# Altium schematic sheet USB-power.SchDoc: Thymio2
size A4; Organization: Original design LSRO-STI-EPFL; Address1: Association Mobsya; Address2: Michael Bonani; Address3: Ch. Closel 3; Address4: CH-1020 Renens; DocumentNumber: 3; Revision: 2.3; SheetNumber: 3; SheetTotal: 9; Engineer: Michael Bonani; Title2: PCB principal; ProjectName: Project Name
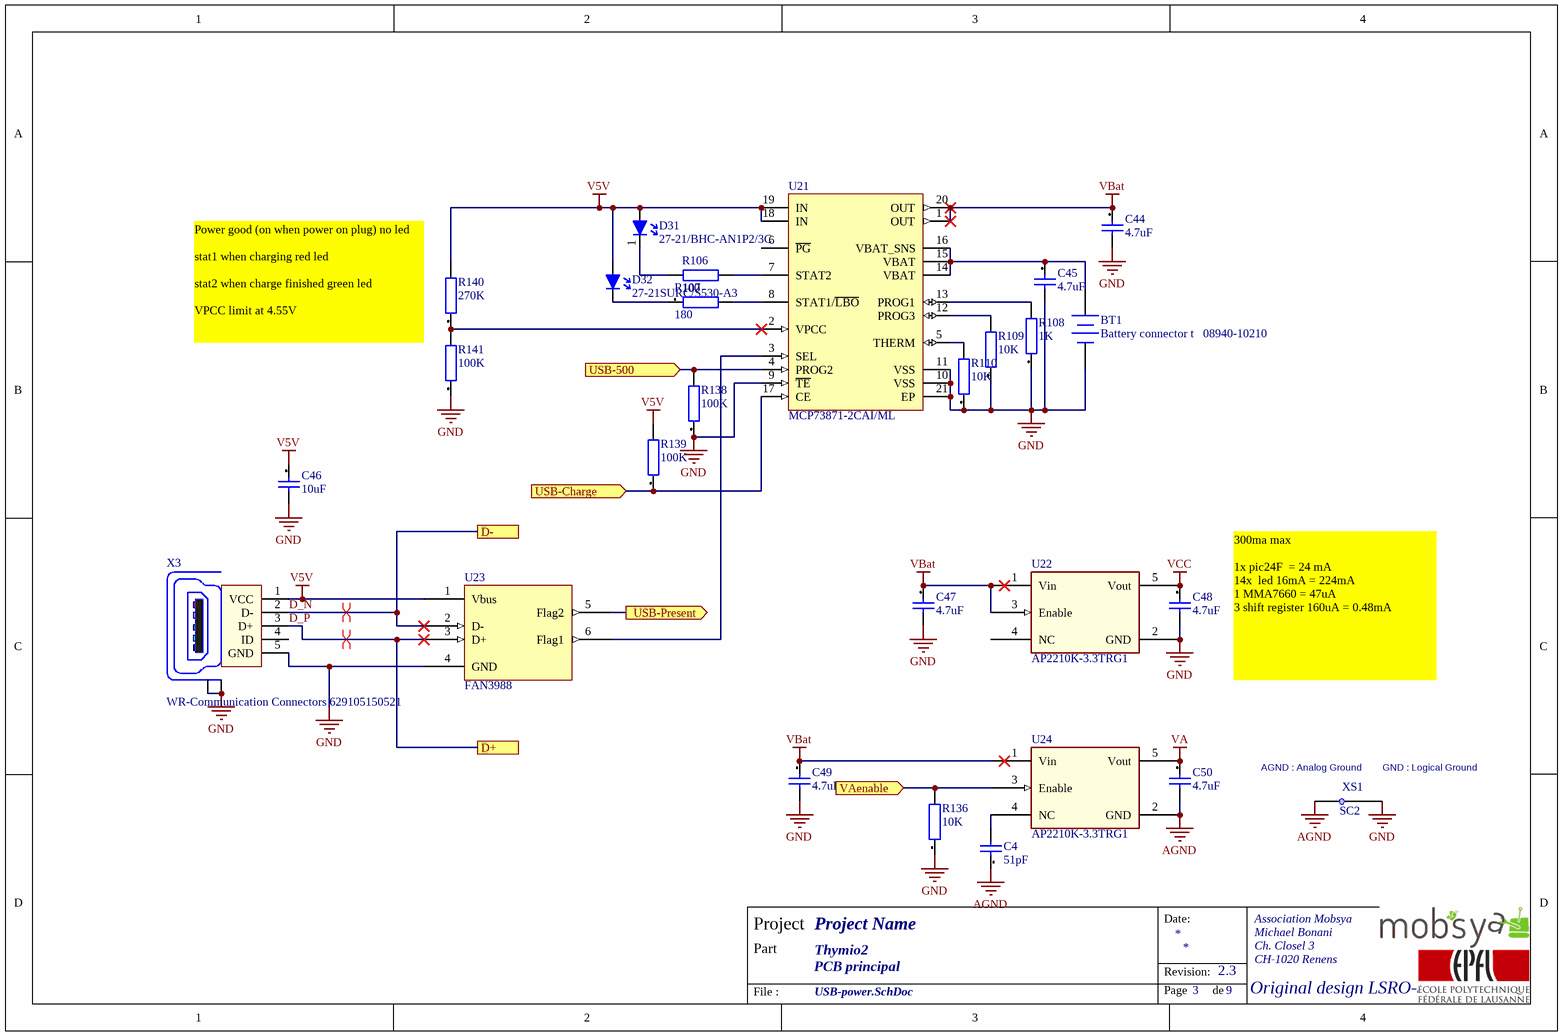
[diagram p0: USB-power.SchDoc]

## Parts
BT1  Battery connector t   08940-10210  [BAT-2]
C4  51pF  [CAPC1005X05N]
C44  4.7uF  [CAPC1005X05N]
C45  4.7uF  [CAPC1005X05N]
C46  10uF  [CAPC1005X05N]
C47  4.7uF  [CAPC1005X05N]
C48  4.7uF  [CAPC1005X05N]
C49  4.7uF  [CAPC1005X05N]
C50  4.7uF  [CAPC1005X05N]
D31  27-21/BHC-AN1P2/3C  [27-21 Everlight Blue]
D32  27-21SURC/S530-A3  [27-21 Everlight]
R106  100  [RESC1005X04N]
R107  180  [RESC1005X04N]
R108  1K  [RESC1005X04N]
R109  10K  [RESC1005X04N]
R110  10K  [RESC1005X04N]
R136  10K  [RESC1005X04N]
R138  100K  [RESC1005X04N]
R139  100K  [RESC1005X04N]
R140  270K  [RESC1005X04N]
R141  100K  [RESC1005X04N]
U21  MCP73871-2CAI/ML  [QFN-ML20_N]
U22  AP2210K-3.3TRG1  [SOT95P285X100-5N]
U23  FAN3988  [MLP 1.45x1mm]
U24  AP2210K-3.3TRG1  [SOT95P285X100-5N]
X3  WR-Communication Connectors 629105150521  [629105150521]
XS1  SC2  [CC_SC2]  (net tie, no BOM)

## Ports
D+, D-, USB-500 (in), USB-Charge (in), USB-Present (out), VAenable (in)

## Nets
AGND: C4.1 C50.2 U24.2(GND) XS1.2
GND: BT1.2(-) C44.2 C45.2 C46.2 C47.2 C48.2 C49.2 R108.1 R109.1 R110.1 R136.1 R138.1 R141.1 U21.9(~{TE}) U21.10(VSS) U21.11(VSS) U21.21(EP) U22.2(GND) U23.4(GND) X3.5(GND) X3.Z1(Shield) X3.Z2(Shield) XS1.1
V5V: C46.1 D31.2(A) D32.2(A) R139.2 R140.2 U21.18(IN) U21.19(IN) U23.1(Vbus) X3.1(VCC)
VA: C50.1 U24.5(Vout)
VBat: C44.1 C47.1 C49.1 U21.1(OUT) U21.20(OUT) U22.1(Vin) U22.3(Enable) U24.1(Vin)
VCC: C48.1 U22.5(Vout)
D_N: U23.2(D-) X3.2(D-) ; port D-
D_P: U23.3(D+) X3.3(D+) ; port D+
USB-500: R138.2 U21.4(PROG2) ; port USB-500
USB-Charge: R139.1 U21.17(CE) ; port USB-Charge
USB-Present: U23.5(Flag2) ; port USB-Present
VAenable: R136.2 U24.3(Enable) ; port VAenable
NetBT1_1: BT1.1(+) C45.1 U21.14(VBAT) U21.15(VBAT) U21.16(VBAT_SNS)
NetC4_2: C4.2 U24.4(NC)
NetD31_1: D31.1(K) R106.2
NetD32_1: D32.1(K) R107.1
NetR106_1: R106.1 U21.7(STAT2)
NetR107_2: R107.2 U21.8(STAT1/~{LBO})
NetR108_2: R108.2 U21.13(PROG1)
NetR109_2: R109.2 U21.12(PROG3)
NetR110_2: R110.2 U21.5(THERM)
NetR140_1: R140.1 R141.2 U21.2(VPCC)
NetU21_3: U21.3(SEL) U23.6(Flag1)

Not connected (* = marked no-connect by the designer): U21 6(~{PG}); U22 4(NC); X3 4(ID)

## Layout directives
differential pair: D_N, D_P

## Notes on the sheet
- Power good (on when power on plug) no led
  stat1 when charging red led
  stat2 when charge finished green led
  VPCC limit at 4.55V
- 300ma max
  1x pic24F		= 24 mA
  14x  led 16mA	= 224mA
  1 MMA7660	= 47uA
  3 shift register 160uA = 0.48mA
- (near XS1) AGND : Analog Ground
- (near XS1) GND : Logical Ground
- Date:
- Project
- Part
- Revision:
- File :
- Page
- de

## Library data of the parts
BT1 = Battery: Multicell Battery; LayerSch: Top; Published: 24-Mar-1999; LatestRevisionDate: 17-Jul-2002; LatestRevisionNote: Re-released for DXP Platform.; PackageReference: BAT-2; Publisher: Altium Limited
C4 = 10nF[[/\]]0603[[/\]]1: Capacitor; Manufacturer: Multicomp; Manufacturer Nr: U0603R103KCT; Preference: 1; Tolerance +: +10; Tolerance -: -10; Dielectric: X7R; Voltage: 50; MaxTemperature: +125; MinTemperature: -55; Quant_1: 10; Quant_2: 100; Quant_3: 1000; Currentie: CHF; LayerSch: Top; Size: 0603; Footprint Acort: 0603_G; Supplier: Farnell; Supplier Nr: 9406182; ComponentLink2Description: Farnell link; ComponentLink2URL: http://ch.farnell.com/jsp/displayProduct.jsp?sku=9406182; Price_1: 0.062; Price_2: 0.041; Price_3: 0.021; ROHS: True; DateLastUpdate: 2007-12-03 / 14:22:34
C44 C45 C47-C50 = 4.7uF[[/\]]0603[[/\]]1: Capacitor; Manufacturer: Kemet; Manufacturer Nr: C0603C475K9PAC; Preference: 1; Tolerance +: +10; Tolerance -: -10; Dielectric: X5R; Voltage: 6.3; MaxTemperature: +85; MinTemperature: -55; Quant_1: 10; Quant_2: 100; Quant_3: 1000; Quant_4: 4000; Currentie: CHF; LayerSch: Top; Size: 0603; Footprint Acort: 0603_G; Supplier: Farnell; Supplier Nr: 9227784; ComponentLink2Description: Farnell link; ComponentLink2URL: http://ch.farnell.com/jsp/displayProduct.jsp?sku=9227784; Price_1: 0.33; Price_2: 0.298; Price_3: 0.278; Price_4: 0.246; ROHS: True; DateLastUpdate: 2007-12-03 / 14:22:57
C46 = 10uF[[/\]]0603[[/\]]1: Capacitor; Manufacturer: Taiyo Yuden; Manufacturer Nr: JMK107BJ106MA-T; Preference: 1; Tolerance +: +15; Tolerance -: -15; Dielectric: X5R; Voltage: 6.3; MaxTemperature: +85; MinTemperature: -55; Quant_2: 100; Quant_3: 500; Currentie: CHF; LayerSch: Top; Size: 0603; Footprint Acort: 0603_G; Supplier: Farnell; Supplier Nr: 1463375; ComponentLink2Description: Farnell link; ComponentLink2URL: http://ch.farnell.com/jsp/displayProduct.jsp?sku=1463375; Quant_1: 1; Price_1: 0.768; Price_2: 0.674; Price_3: 0.372; ROHS: True; DateLastUpdate: 2007-12-03 / 14:22:36
D31 = LED: SMD Blue led right angle mount 3.3V@20ma 28mcd; VerifiedComment: ToDo; LayerSch: Top
D32 = LED: SMD Red led right angle mount 2V@20ma 57mcd; VerifiedComment: ToDo; LayerSch: Top
R106 = RES_ACORT: Resistance; ClassName: IR
R107 = 180R[[/\]]0603[[/\]]1: Resistor; Manufacturer: Vishay; Manufacturer Nr: D11CRCW06030B4703F; Tolerance: +/-1; Preference: 1; Power: 0.1; Voltage: 75; Current: 1.5; ppm/K: +/-100; Quant_1: 10; Quant_2: 100; Quant_3: 500; Currentie: CHF; LayerSch: Top; Size: 0603; Footprint Acort: 0603; Supplier: Distrelec; Supplier Nr: 715570; ComponentLink2Description: Distrelec link; ComponentLink2URL: http://www.distrelec.com/ishopWebFront/search/luceneSearch.do?dispatch=find&showImage=on&artnrPhrase=715570; ROHS: True; Price_1: 0.0538; Price_2: 0.0323; Price_3: 0.0204; DateLastUpdate: 2007-12-03 / 16:30:19
R108 = 1K[[/\]]0603[[/\]]1: Resistor; Manufacturer: Vishay; Manufacturer Nr: D11CRCW06030B1001F; Tolerance: +/-1; Preference: 1; Power: 0.1; Voltage: 75; Current: 1.5; ppm/K: +/-100; Quant_1: 10; Quant_2: 100; Quant_3: 500; Currentie: CHF; LayerSch: Top; Size: 0603; Footprint Acort: 0603; Supplier: Distrelec; Supplier Nr: 715588; ComponentLink2Description: Distrelec link; ComponentLink2URL: http://www.distrelec.com/ishopWebFront/search/luceneSearch.do?dispatch=find&showImage=on&artnrPhrase=715588; ROHS: True; Price_1: 0.0753; Price_2: 0.0538; Price_3: 0.0215; DateLastUpdate: 2009-01-20 / 09:40:15
R109 R110 R141 = 10K[[/\]]0603[[/\]]1: Resistor; Manufacturer: Vishay; Manufacturer Nr: D11CRCW06030B1002F; Tolerance: +/-1; Preference: 1; Power: 0.1; Voltage: 75; Current: 1.5; ppm/K: +/-100; Quant_1: 10; Quant_2: 100; Quant_3: 500; Currentie: CHF; LayerSch: Top; Size: 0603; Footprint Acort: 0603; ComponentLink1Description: OnLine datasheet; Supplier: Distrelec; Supplier Nr: 715612; ComponentLink2Description: Distrelec link; ComponentLink2URL: http://www.distrelec.com/ishopWebFront/search/luceneSearch.do?dispatch=find&showImage=on&artnrPhrase=715612; ROHS: True; Price_1: 0.0538; Price_2: 0.0323; Price_3: 0.0204; DateLastUpdate: 2007-12-03 / 16:29:57
R136 = 10K[[/\]]0603[[/\]]2: Resistor; Manufacturer: Multicomp; Manufacturer Nr: MC 0.063W 0603 1% 10K; Tolerance: +/-1; Preference: 2; Power: 0.063; Voltage: 50; Current: 1; ppm/K: +/-100; Quant_2: 250; Quant_3: 1000; Quant_4: 5000; Quant_5: 15000; Currentie: CHF; LayerSch: Top; Size: 0603; Footprint Acort: 0603; ComponentLink1Description: OnLine datasheet; Supplier: Farnell; Supplier Nr: 9330399; ComponentLink2Description: Farnell link; ComponentLink2URL: http://ch.farnell.com/jsp/displayProduct.jsp?sku=9330399; ROHS: True; Quant_1: 50; Price_1: 0.062; Price_2: 0.049; Price_3: 0.038; Price_4: 0.027; Price_5: 0.021; DateLastUpdate: 2007-11-29 / 09:14:40
R138 R139 = 100K[[/\]]0603[[/\]]1: Resistor; Manufacturer: Vishay; Manufacturer Nr: D11CRCW06030B1003F; Tolerance: +/-1; Preference: 1; Power: 0.1; Voltage: 75; Current: 1.5; ppm/K: +/-100; Quant_1: 10; Quant_2: 100; Quant_3: 500; Currentie: CHF; LayerSch: Top; Size: 0603; Footprint Acort: 0603; ComponentLink1Description: OnLine datasheet; Supplier: Distrelec; Supplier Nr: 715636; ComponentLink2Description: Distrelec link; ComponentLink2URL: http://www.distrelec.com/ishopWebFront/search/luceneSearch.do?dispatch=find&showImage=on&artnrPhrase=715636; ROHS: True; Price_1: 0.0538; Price_2: 0.0323; Price_3: 0.0204; DateLastUpdate: 2007-12-03 / 16:29:58
R140 = 270K[[/\]]0603[[/\]]2: Resistor; Manufacturer: Multicomp; Manufacturer Nr: MC 0.063W 0603 1% 270K; Tolerance: +/-1; Preference: 2; Power: 0.063; Voltage: 50; Current: 1; ppm/K: +/-100; Quant_2: 250; Quant_3: 1000; Quant_4: 5000; Quant_5: 15000; Currentie: CHF; LayerSch: Top; Size: 0603; Footprint Acort: 0603; Supplier: Farnell; Supplier Nr: 9330941; ComponentLink2Description: Farnell link; ComponentLink2URL: http://ch.farnell.com/jsp/displayProduct.jsp?sku=9330941; ROHS: True; Quant_1: 50; Price_1: 0.062; Price_2: 0.049; Price_3: 0.038; Price_4: 0.027; Price_5: 0.021; DateLastUpdate: 2007-11-29 / 09:14:02
U21 = MCP73871-2AAI/ML: Stand-Alone System Load Sharing and Li-Ion/Li-Polymer Battery Charge Management Controller, 4.2V, 20-Pin QFN, Industrial Temperature; LayerSch: Top; FirstPublished: 29-Jan-2009; LatestRevisionDate: 27-Nov-2009; LatestRevisionNote: Updated to datasheet revision B, May-2009; DatasheetVersion: revB, May-2009; PackageVersion: revBB, Aug-2009; PackageReference: QFN-ML20; Publisher: Altium Limited; PackageDescription: 20-Lead Plastic Quad Flat, No Lead Package (ML) - 4x4x0.9 mm Body [QFN]; Supplier 1: Digi-Key; Supplier Part Number 1: MCP73871-2AAI/ML-ND; Supplier 2: Farnell; Supplier Part Number 2: 1642487; Supplier 3: Newark; Supplier Part Number 3: 54M4955; ComponentLink1Description: Datasheet; ComponentLink1URL: http://ww1.microchip.com/downloads/en/DeviceDoc/22090b.pdf; ComponentLink2Description: Packaging Specification; ComponentLink2URL: http://www.microchip.com/stellent/groups/techpub_sg/documents/packagingspec/en012702.pdf; ComponentLink3Description: Microchip.com Home; ComponentLink3URL: http://www.microchip.com/
U22 U24 = AP7331: 300mA, Low Quiescent Current, Fast Transient LDO; LayerSch: Top
U23 = FAN3988: USB/Charger and Over Voltage Detection Device; LayerSch: Top
X3 = WR-Communication Connectors 629105150521: WR-COM_USB_Micro Type B_Horizontal_SMT; Manufacturer: Würth Elektronik eiSos GmbH; ComponentLink1 Description: Manufacturer; ComponentLink2 Description: Datasheet; NoPins: 5; ComponentLink1URL: http://www.we-online.de; ComponentLink2URL: http://katalog.we-online.de/em/datasheet/629105150521.pdf; Created by: Karrer Zheng; Created Date: 10/21/2014; partNo: 629105150521
XS1 = SC2: Short Circuit 2 Connections; LayerSch: Top